# Altium schematic sheet water_quality_sensor_hub.SchDoc
size A4
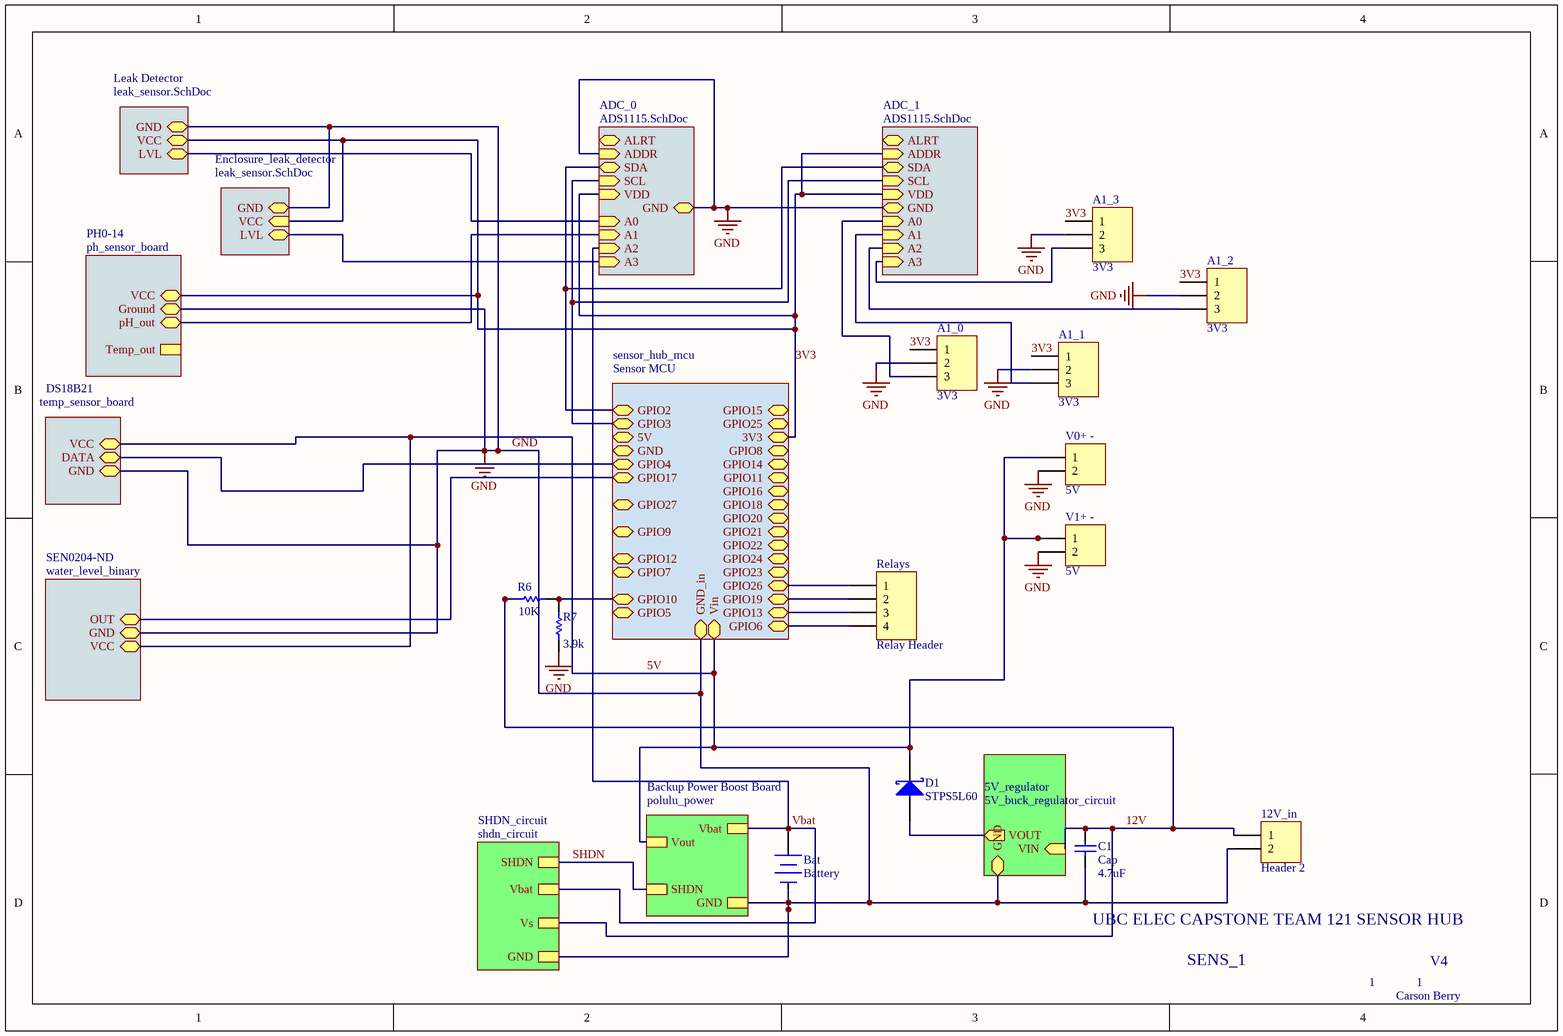
[diagram p0: water_quality_sensor_hub.SchDoc]

## Parts
12V_in  Header 2  [2_channel_terminal_block]
A1_0  3V3  [3_channel_terminal_block]
A1_1  3V3  [3_channel_terminal_block]
A1_2  3V3  [3_channel_terminal_block]
A1_3  3V3  [3_channel_terminal_block]
Bat  Battery  [BAT-2]
C1  Cap  value 4.7uF  [RAD-0.3]
D1  STPS5L60  [STM-DO-201AD]
R6  value 10K  [AXIAL-0.3]  (hidden comment: Res1)
R7  value 3.9k  [AXIAL-0.3]  (hidden comment: Res1)
Relays  Relay Header  [4_channel_terminal_block]
V0+_-  5V  [2_channel_terminal_block]
V1+_-  5V  [2_channel_terminal_block]

## Sub-sheets
5V_regulator = 5V_buck_regulator_circuit: VOUT (out), GND (bidir), VIN (in)
ADC_0 = ADS1115.SchDoc: A2 (in), ALRT (bidir), ADDR (in), SDA (bidir), SCL (in), A3 (in), GND (bidir), A0 (in), A1 (in), VDD (in)
ADC_1 = ADS1115.SchDoc: A2 (in), ALRT (bidir), ADDR (in), SDA (bidir), SCL (in), A3 (in), GND (bidir), A0 (in), A1 (in), VDD (in)
Backup Power Boost Board = polulu_power: SHDN, Vbat, Vout, GND
DS18B21 = temp_sensor_board: VCC (bidir), DATA (bidir), GND (bidir)
Enclosure_leak_detector = leak_sensor.SchDoc: GND (bidir), VCC (in), LVL (bidir)
Leak Detector = leak_sensor.SchDoc: GND (bidir), VCC (bidir), LVL (bidir)
PH0-14 = ph_sensor_board: VCC (bidir), Ground (bidir), pH_out (bidir), Temp_out
SEN0204-ND = water_level_binary: OUT (bidir), GND (bidir), VCC (bidir)
Sensor MCU = sensor_hub_mcu: GPIO2 (bidir), GPIO3 (bidir), GND (bidir), GPIO15 (bidir), GPIO17 (bidir), GPIO10 (bidir), GPIO8 (bidir), GPIO14 (bidir), GPIO11 (bidir), GPIO16 (bidir), GPIO18 (bidir), GPIO20 (bidir), GPIO21 (bidir), GPIO22 (bidir), GPIO24 (bidir), GPIO23 (bidir), GPIO25 (bidir), GPIO26 (bidir), 5V (bidir), GPIO19 (bidir), GPIO9 (bidir), GPIO13 (bidir), GPIO12 (bidir), GPIO7 (bidir), GPIO6 (bidir), GPIO4 (bidir), GPIO5 (bidir), 3V3 (bidir), GPIO27 (bidir), Vin (bidir), GND_in (bidir)
SHDN_circuit = shdn_circuit: GND, Vbat, Vs, SHDN

## Nets
GND: 12V_in.2 A1_0.2 A1_1.2 A1_2.2 A1_3.2 Bat.2(-) C1.1 R7.1 V0+_-.2 V1+_-.2 ; sheet PH0-14/Ground, sheet DS18B21/GND, sheet Sensor MCU/GND_in, sheet SEN0204-ND/GND, sheet Leak Detector/GND, sheet ADC_0/ADDR, sheet ADC_0/GND, sheet 5V_regulator/GND, sheet Backup Power Boost Board/GND, sheet SHDN_circuit/GND, sheet ADC_1/GND, sheet Enclosure_leak_detector/GND
3V3: A1_0.1 A1_1.1 A1_2.1 A1_3.1 ; sheet PH0-14/VCC, sheet Sensor MCU/3V3, sheet Leak Detector/VCC, sheet ADC_0/VDD, sheet ADC_1/ADDR, sheet ADC_1/VDD, sheet Enclosure_leak_detector/VCC
5V: D1.1(K) V0+_-.1 V1+_-.1 ; sheet DS18B21/VCC, sheet Sensor MCU/Vin, sheet SEN0204-ND/VCC, sheet Backup Power Boost Board/Vout
12V: 12V_in.1 C1.2 R6.1 ; sheet 5V_regulator/VIN, sheet SHDN_circuit/Vs
SHDN: sheet Backup Power Boost Board/SHDN, sheet SHDN_circuit/SHDN
Vbat: Bat.1(+) ; sheet ADC_0/A2, sheet Backup Power Boost Board/Vbat, sheet SHDN_circuit/Vbat
NetA1_0_3: A1_0.3 ; sheet ADC_1/A0
NetA1_1_3: A1_1.3 ; sheet ADC_1/A1
NetA1_2_3: A1_2.3 ; sheet ADC_1/A2
NetA1_3_3: A1_3.3 ; sheet ADC_1/A3
NetD1_2: D1.2(A) ; sheet 5V_regulator/VOUT
NetR6_2: R6.2 R7.2 ; sheet Sensor MCU/GPIO10
NetRelays_1: Relays.1 ; sheet Sensor MCU/GPIO26
NetRelays_2: Relays.2 ; sheet Sensor MCU/GPIO19
NetRelays_3: Relays.3 ; sheet Sensor MCU/GPIO13
NetRelays_4: Relays.4 ; sheet Sensor MCU/GPIO6
(unnamed): sheet PH0-14/pH_out, sheet ADC_0/A1
(unnamed): sheet DS18B21/DATA, sheet Sensor MCU/GPIO4
(unnamed): sheet Sensor MCU/GPIO2, sheet ADC_0/SDA, sheet ADC_1/SDA
(unnamed): sheet Sensor MCU/GPIO3, sheet ADC_0/SCL, sheet ADC_1/SCL
(unnamed): sheet Sensor MCU/GPIO17, sheet SEN0204-ND/OUT
(unnamed): sheet Leak Detector/LVL, sheet ADC_0/A0
(unnamed): sheet ADC_0/A3, sheet Enclosure_leak_detector/LVL

## Notes on the sheet
- UBC ELEC CAPSTONE TEAM 121 SENSOR HUB
- SENS_1
- 1
- V4
- Carson Berry

## Library data of the parts
12V_in = Header 2: Power 12V in; LatestRevisionDate: 17-Jul-2002; LatestRevisionNote: Re-released for DXP Platform.; Publisher: Altium Limited
A1_0-A1_3 = Header 3: Header, 3-Pin; LatestRevisionDate: 17-Jul-2002; LatestRevisionNote: Re-released for DXP Platform.; Publisher: Altium Limited
Bat = Battery: 2AA batteries; Published: 24-Mar-1999; LatestRevisionDate: 17-Jul-2002; LatestRevisionNote: Re-released for DXP Platform.; PackageReference: BAT-2; Publisher: Altium Limited; PackageDescription: Battery; 2 Leads
C1 = Cap: Capacitor; Published: 8-Jun-2000; LatestRevisionDate: 17-Jul-2002; LatestRevisionNote: Re-released for DXP Platform.; PackageReference: RAD-0.3; Publisher: Altium Limited; PackageDescription: Radial Cap, Thru-Hole; 2 Leads; 0.3 in Pin Spacing
D1 = CMP-2000-05365-1: Power Schottky rectifier, 60 V, 5 A, 2-Pin DO-201AD, RoHS, Cut Tape; Manufacturer: STMicroelectronics; Other Related Documents: STPS5L60ViewAllSpecifications; Online Catalog: SchottkyDiode; Current - Average Rectified (Io): 5A; Speed: FastRecovery=200mA(Io); Current - Reverse Leakage @ Vr: 220µA@60V; Other Names: 497-12673-3STPS5L60-ND; Voltage - DC Reverse (Vr) (Max): 60V; Voltage - Forward (Vf) (Max) @ If: 520mV@5A; Package Description: 2-Pin Axial Lead, Dia 5.3 mm, Body Length 9.5 mm; Datasheet Version: Rev. 3, 05/2008; Datasheet URL: http://download.siliconexpert.com/pdfs/2012/8/10/13/5/5/781/st_/manual/cd00002924.pdf; Operating Temperature - Junction: 150degC(Max); Capacitance @ Vr, F: -; Manufacturer URL: http://www.st.com/; Standard Package: 600; Diode Type: Schottky; Package Reference: DO-201AD; Category: DiscreteSemiconductorProducts; Package / Case: DO-201AD,Axial; Family: Diodes,Rectifiers-Single; Packaging: Tape&Box(TB); Supplier Device Package: DO-201AD; Reverse Recovery Time (trr): -; Package URL: http://download.siliconexpert.com/pdfs/2012/8/10/13/5/5/781/st_/manual/cd00002924.pdf; Mounting Type: ThroughHole; Series: -
R6 R7 = Res1: Resistor; Published: 8-Jun-2000; LatestRevisionDate: 17-Jul-2002; LatestRevisionNote: Re-released for DXP Platform.; PackageReference: AXIAL-0.3; Publisher: Altium Limited; PackageDescription: Axial Device, Thru-Hole; 2 Leads; 0.3 in Pin Spacing
Relays = Header 4: Relay Control; LatestRevisionDate: 17-Jul-2002; LatestRevisionNote: Re-released for DXP Platform.; Publisher: Altium Limited
V0+_- V1+_- = Header 2: Header, 2-Pin; LatestRevisionDate: 17-Jul-2002; LatestRevisionNote: Re-released for DXP Platform.; Publisher: Altium Limited